# Altium schematic sheet sk9822_array.SchDoc
size A4; SheetNumber: 2; SheetTotal: 2
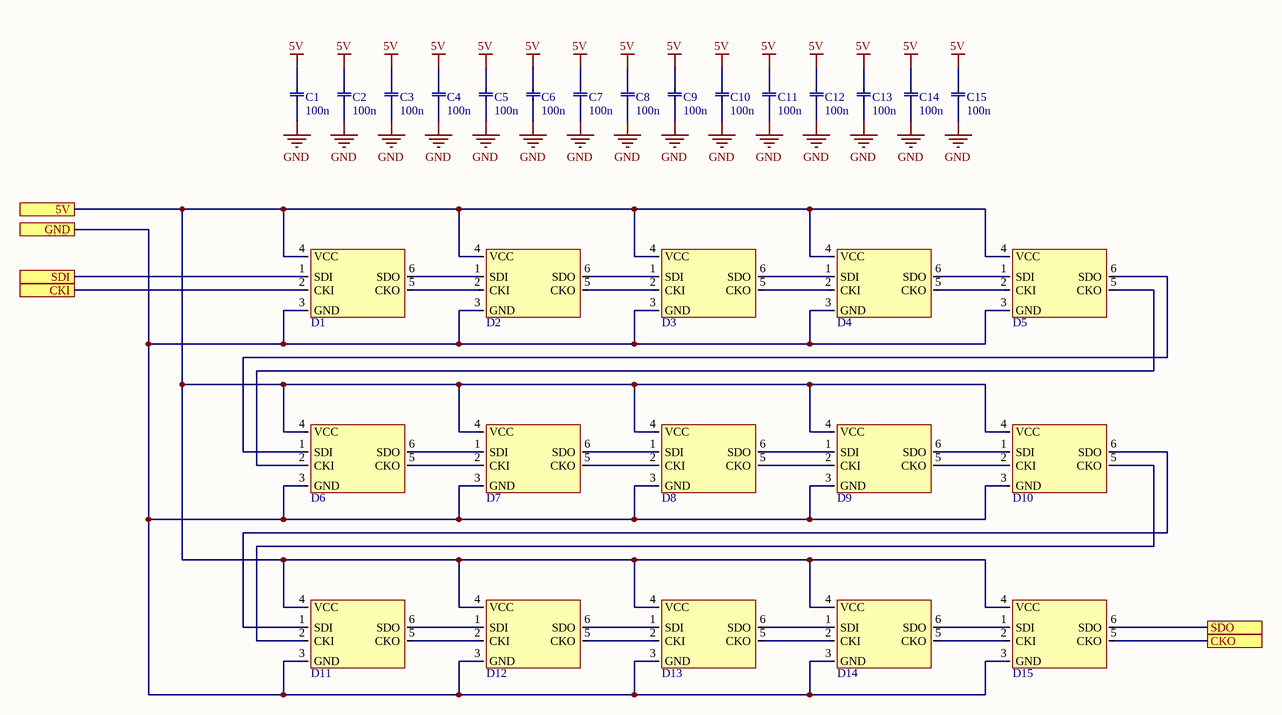
[diagram p0: sk9822_array.SchDoc]

## Parts
C1  value 100n  [0603 cap]  (hidden comment: 0603, capacitor)
C2  value 100n  [0603 cap]  (hidden comment: 0603, capacitor)
C3  value 100n  [0603 cap]  (hidden comment: 0603, capacitor)
C4  value 100n  [0603 cap]  (hidden comment: 0603, capacitor)
C5  value 100n  [0603 cap]  (hidden comment: 0603, capacitor)
C6  value 100n  [0603 cap]  (hidden comment: 0603, capacitor)
C7  value 100n  [0603 cap]  (hidden comment: 0603, capacitor)
C8  value 100n  [0603 cap]  (hidden comment: 0603, capacitor)
C9  value 100n  [0603 cap]  (hidden comment: 0603, capacitor)
C10  value 100n  [0603 cap]  (hidden comment: 0603, capacitor)
C11  value 100n  [0603 cap]  (hidden comment: 0603, capacitor)
C12  value 100n  [0603 cap]  (hidden comment: 0603, capacitor)
C13  value 100n  [0603 cap]  (hidden comment: 0603, capacitor)
C14  value 100n  [0603 cap]  (hidden comment: 0603, capacitor)
C15  value 100n  [0603 cap]  (hidden comment: 0603, capacitor)
D1  Neo - SK9822  [SK9822_FLIPPED]  (value not drawn)
D2  Neo - SK9822  [SK9822_FLIPPED]  (value not drawn)
D3  Neo - SK9822  [SK9822_FLIPPED]  (value not drawn)
D4  Neo - SK9822  [SK9822_FLIPPED]  (value not drawn)
D5  Neo - SK9822  [SK9822_FLIPPED]  (value not drawn)
D6  Neo - SK9822  [SK9822_FLIPPED]  (value not drawn)
D7  Neo - SK9822  [SK9822_FLIPPED]  (value not drawn)
D8  Neo - SK9822  [SK9822_FLIPPED]  (value not drawn)
D9  Neo - SK9822  [SK9822_FLIPPED]  (value not drawn)
D10  Neo - SK9822  [SK9822_FLIPPED]  (value not drawn)
D11  Neo - SK9822  [SK9822_FLIPPED]  (value not drawn)
D12  Neo - SK9822  [SK9822_FLIPPED]  (value not drawn)
D13  Neo - SK9822  [SK9822_FLIPPED]  (value not drawn)
D14  Neo - SK9822  [SK9822_FLIPPED]  (value not drawn)
D15  Neo - SK9822  [SK9822_FLIPPED]  (value not drawn)

## Ports
5V, CKI, CKO, GND, SDI, SDO

## Nets
5V: C1.1 C2.1 C3.1 C4.1 C5.1 C6.1 C7.1 C8.1 C9.1 C10.1 C11.1 C12.1 C13.1 C14.1 C15.1
GND: C1.0 C2.0 C3.0 C4.0 C5.0 C6.0 C7.0 C8.0 C9.0 C10.0 C11.0 C12.0 C13.0 C14.0 C15.0
5V: D1.4(VCC) D2.4(VCC) D3.4(VCC) D4.4(VCC) D5.4(VCC) D6.4(VCC) D7.4(VCC) D8.4(VCC) D9.4(VCC) D10.4(VCC) D11.4(VCC) D12.4(VCC) D13.4(VCC) D14.4(VCC) D15.4(VCC) ; port 5V  [a separate net that carries the same name]
CKI: D1.2(CKI) ; port CKI
CKO: D15.5(CKO) ; port CKO
GND: D1.3(GND) D2.3(GND) D3.3(GND) D4.3(GND) D5.3(GND) D6.3(GND) D7.3(GND) D8.3(GND) D9.3(GND) D10.3(GND) D11.3(GND) D12.3(GND) D13.3(GND) D14.3(GND) D15.3(GND) ; port GND  [a separate net that carries the same name]
SDI: D1.1(SDI) ; port SDI
SDO: D15.6(SDO) ; port SDO
NetD1_5: D1.5(CKO) D2.2(CKI)
NetD1_6: D1.6(SDO) D2.1(SDI)
NetD2_5: D2.5(CKO) D3.2(CKI)
NetD2_6: D2.6(SDO) D3.1(SDI)
NetD3_5: D3.5(CKO) D4.2(CKI)
NetD3_6: D3.6(SDO) D4.1(SDI)
NetD4_5: D4.5(CKO) D5.2(CKI)
NetD4_6: D4.6(SDO) D5.1(SDI)
NetD5_5: D5.5(CKO) D6.2(CKI)
NetD5_6: D5.6(SDO) D6.1(SDI)
NetD6_5: D6.5(CKO) D7.2(CKI)
NetD6_6: D6.6(SDO) D7.1(SDI)
NetD7_5: D7.5(CKO) D8.2(CKI)
NetD7_6: D7.6(SDO) D8.1(SDI)
NetD8_5: D8.5(CKO) D9.2(CKI)
NetD8_6: D8.6(SDO) D9.1(SDI)
NetD9_5: D9.5(CKO) D10.2(CKI)
NetD9_6: D9.6(SDO) D10.1(SDI)
NetD10_5: D10.5(CKO) D11.2(CKI)
NetD10_6: D10.6(SDO) D11.1(SDI)
NetD11_5: D11.5(CKO) D12.2(CKI)
NetD11_6: D11.6(SDO) D12.1(SDI)
NetD12_5: D12.5(CKO) D13.2(CKI)
NetD12_6: D12.6(SDO) D13.1(SDI)
NetD13_5: D13.5(CKO) D14.2(CKI)
NetD13_6: D13.6(SDO) D14.1(SDI)
NetD14_5: D14.5(CKO) D15.2(CKI)
NetD14_6: D14.6(SDO) D15.1(SDI)

## Library data of the parts
D1-D15 = Neo - SK9822: Value: WS2812; DigiKey: 1568-1800-ND
C1-C15 = 0603, capacitor: Order number: *